# Altium project EEE3061WDesignProject_LineSensor.PrjPcb
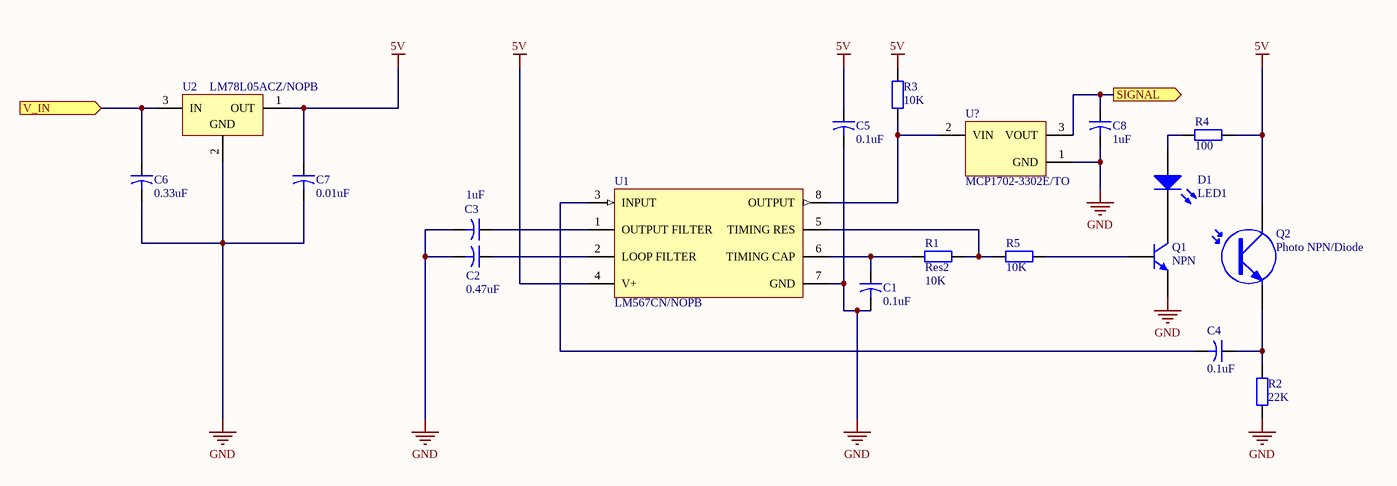
[diagram p0: LineSensorSchematic.SchDoc]
1 sheet, 19 parts. Net scope: flat (ports and power ports of the same name join across sheets).

## Sheet LineSensorSchematic.SchDoc
size A4; PageSetup: Record=PageOptions|CenterHorizontal=True|CenterVertical=True|PrintScale=1.00|XCorrection=1.00|YCorrection=1.00|PrintKind=1|BorderSize=5000000|LeftOffset=0|BottomOffset=0|Orientation=2|PaperLength=2970|PaperWidth=2100|Scale=100|PaperSource=7|PrintQuality=600|MediaType=1|DitherType=10|PrintScaleMode=1|PaperKind=A4|PaperIndex=9

### Parts
C1  0.1uF  [CAPR5-4X5]
C2  0.47uF  [CAPR5-4X5]
C3  1uF  [CAPR5-4X5]
C4  0.1uF  [CAPR5-4X5]
C5  0.1uF  [CAPR5-4X5]
C6  0.33uF  [CAPR5-4X5]
C7  0.01uF  [CAPR5-4X5]
C8  1uF  [CAPR5-4X5]
D1  LED1  [LED-1]
Q1  NPN  [TO-226-AA]
Q2  Photo NPN/Diode  [TO-220_A]
R1  Res2  value 10K  [AXIAL-0.4]
R2  22K  [AXIAL-0.4]
R3  10K  [AXIAL-0.4]
R4  100  [AXIAL-0.4]
R5  10K  [AXIAL-0.4]
U1  LM567CN/NOPB  [N08E]
U2  LM78L05ACZ/NOPB  [Z03A]
U?  MCP1702-3302E/TO  [TO-92-TO3]

### Ports
SIGNAL (out), V_IN (in)

### Nets
5V: C5.1 C7.1 Q2.1(C) R3.1 R4.1 U1.4(V+) U2.1(OUT)
GND: C1.2 C2.2 C3.2 C5.2 C6.2 C7.2 C8.2 Q1.3(E) R2.2 U1.7(GND) U2.2(GND) U?.1(GND)
NetC1_1: C1.1 R1.2 U1.6(TIMING_CAP)
NetC2_1: C2.1 U1.2(LOOP_FILTER)
NetC3_1: C3.1 U1.1(OUTPUT_FILTER)
NetC4_1: C4.1 Q2.3(E) R2.1
NetC4_2: C4.2 U1.3(INPUT)
NetC6_1: C6.1 U2.3(IN) ; port V_IN
NetC8_1: C8.1 U?.3(VOUT) ; port SIGNAL
NetD1_1: D1.1(A) R4.2
NetD1_2: D1.2(K) Q1.1(C)
NetQ1_2: Q1.2(B) R5.1
NetR1_1: R1.1 R5.2 U1.5(TIMING_RES)
NetR3_2: R3.2 U1.8(OUTPUT) U?.2(VIN)

### Library data of the parts
C1-C8 = Cap2: Capacitor; Published: 23-Sep-2002; PackageReference: CAPR5-4X5; Publisher: Altium Limited; PackageDescription: Capacitor; 2 Leads
  C1 C4 C5: Value: 0.1uF
  C2: Value: 0.47uF
  C3 C8: Value: 1uF
  C6: Value: 0.33uF
  C7: Value: 0.01uF
D1 = LED1: Typical RED GaAs LED; Published: 8-Jun-2000; LatestRevisionDate: 08-Jul-2005; LatestRevisionNote: Mech Layer 1 removed.; PackageReference: LED-1; Publisher: Altium Limited; PackageDescription: LED; 2 Leads
Q1 = NPN: NPN Bipolar Transistor; Published: 8-Jun-2000; LatestRevisionDate: 17-Jul-2002; LatestRevisionNote: Re-released for DXP Platform.; PackageReference: TO-226-AA; Publisher: Altium Limited; PackageDescription: TO, Flat Index; 3 In-Line, Axial Leads; Body Dia. 4.8mm; Leads 0.55 x 0.51 mm (max); Code_JEDEC: TO-226-AA
Q2 = Photo NPN: NPN Phototransistor; Published: 24-Mar-1999; LatestRevisionDate: 17-Jul-2002; LatestRevisionNote: Re-released for DXP Platform.; PackageReference: TO-220_A; Publisher: Altium Limited; Code_JEDEC: TO-220-AC
R1-R5 = Res2: Resistor; Published: 8-Jun-2000; LatestRevisionDate: 17-Jul-2002; LatestRevisionNote: Re-released for DXP Platform.; PackageReference: AXIAL-0.4; Publisher: Altium Limited; PackageDescription: Axial Device, Thru-Hole; 2 Leads; 0.4 in Pin Spacing
  R2: Value: 22K
  R3 R5: Value: 10K
  R4: Value: 100
U1 = CMP-0057-00046-2: Tone Decoder, 8-pin MDIP, Pb-Free; Manufacturer: National Semiconductor; CompType: Audio IC; PackageTopMarking: NSUZXYTTE#*LM*567CN; PowerWise: N; RevisionNote: Component URLs added; ComponentLink3URL: http://www.national.com/packaging/folders/n08e.html; ComponentLink1URL: http://www.national.com/ds/LM/LM567C.pdf; ComponentLink2URL: http://www.national.com/pf/LM/LM567C.html; ComponentLink2Description: LM567C Web Page; PackageDescription: MDIP, .365 x .250 x .130in, 8 Lead, .100in Pitch; PinCount: 8; Code_JEDEC: MS-001-BA; ComponentLink3Description: N08E Package Page; DatasheetVersion: Feb-2003; RoHS: Y; PackageReference: N08E; ComponentLink1Description: LM567C Datasheet; PackageVersion: revG, May-2006
U2 = CMP-0062-00040-3: 3-Terminal Positive Regulator, 5 Vout, 3-pin TO-92, Pb-Free; Manufacturer: National Semiconductor; CompType: LDO IC; PowerWise: N; PackageTopMarking: NSXYTT*LM78L*05ACZ; High-Reliability: Y; RoHS: Y; ComponentLink4Description: Z03A Package Page; PackageVersion: revG, Sep-2000; ComponentLink2Description: LM78L05 Datasheet; ComponentLink3Description: LM78L05 Web Page; DatasheetVersion: Apr-2011; PinCount: 3; RevisionNote: DatasheetVersion updated.; ComponentLink1URL: http://www.national.com/; PackageDescription: TO-92, Molded, 3 Lead; PackageReference: Z03A; PartNumber: LM78L05ACZ/NOPB; ComponentLink3URL: http://www.national.com/pf/LM/LM78L05.html; ComponentLink1Description: Manufacturer URL; Code_JEDEC: TO-226-AA; ComponentLink2URL: http://www.national.com/ds/LM/LM78L05.pdf; ComponentLink4URL: http://www.national.com/packaging/folders/z03a.html
U? = CMP-0136-00017-1: 250 mA Low Quiescent Current LDO Regulator, 3-Pin TO-92, Extended TemperatureBAG; PackageVersion: revBB, Aug-2009; DatasheetVersion: revD, Jun-2009; PackageDescription: 3-Lead Plastic Transistor Outline (TO) [TO-92]; PackageReference: TO-92-TO3